# Altium schematic sheet VNA_1.SchDoc: VNA
size 409 x 289 mm; Origin: Eagle; OriginPath: C:\Users\Ground Lab\Desktop\LibreVNA\Hardware\Eagle\VNA.sch; OriginSheet: 2; OriginDescription: CLK Generation; Date: 04.05.2025 20:03:37; SheetNumber: 2; GateName_1: G$1; SymbolName_1: A3L-LOC; LibraryName: VNA; DeviceSetName: A3L-LOC; Sheet: Sheet:
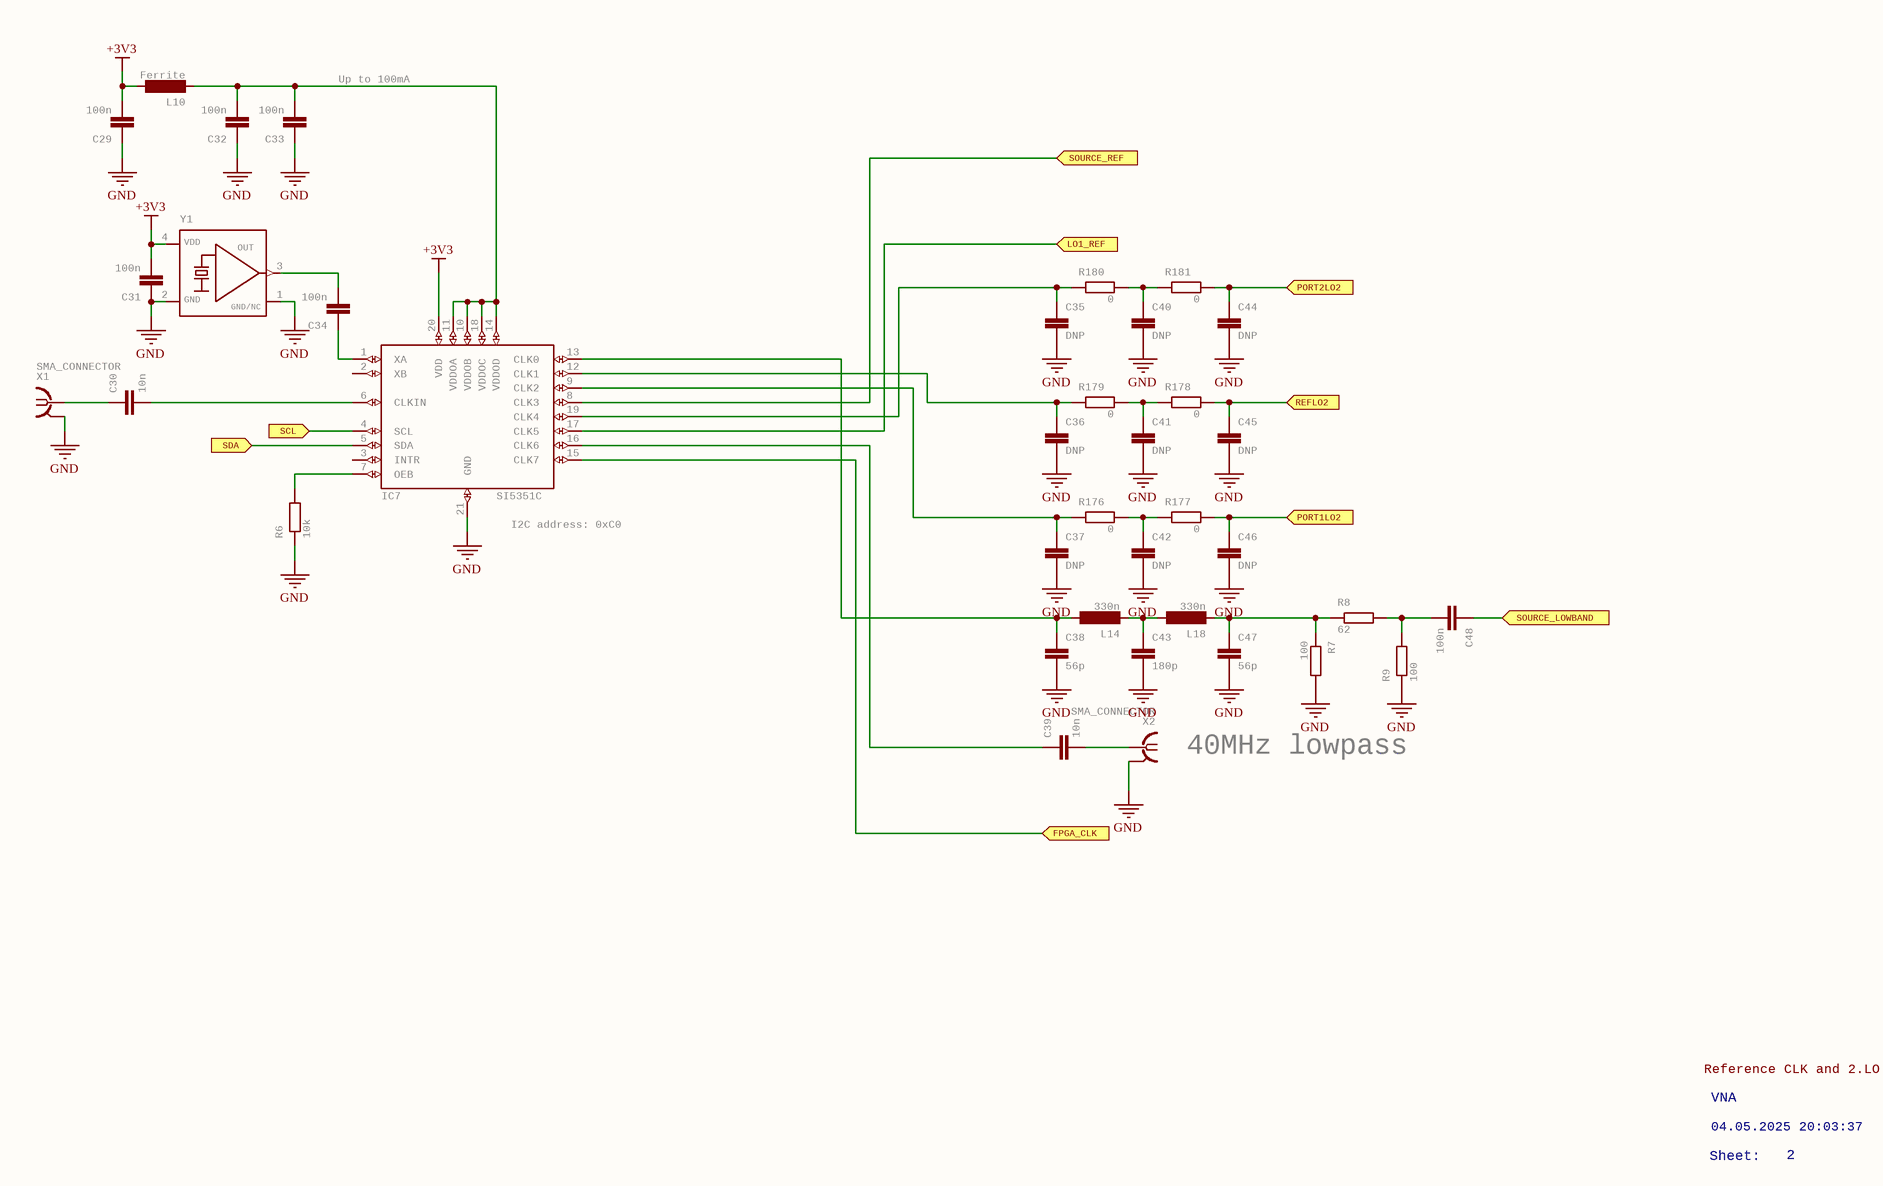
[diagram p0: VNA_1.SchDoc]

## Parts
C29  100n  [C0402]
C30  10n  [C0402]
C31  100n  [C0402]
C32  100n  [C0402]
C33  100n  [C0402]
C34  100n  [C0402]
C35  DNP  [C0402]
C36  DNP  [C0402]
C37  DNP  [C0402]
C38  56p  [C0402]
C39  10n  [C0402]
C40  DNP  [C0402]
C41  DNP  [C0402]
C42  DNP  [C0402]
C43  180p  [C0402]
C44  DNP  [C0402]
C45  DNP  [C0402]
C46  DNP  [C0402]
C47  56p  [C0402]
C48  100n  [C0402]
IC7  SI5351C  [QFN50P400X400X90-21T270N]
L10  Ferrite  [R0402]
L14  330n  [L0402]
L18  330n  [L0402]
R6  10k  [R0402]
R7  100  [R0402]
R8  62  [R0402]
R9  100  [R0402]
R176  0  [R0402]
R177  0  [R0402]
R178  0  [R0402]
R179  0  [R0402]
R180  0  [R0402]
R181  0  [R0402]
X1  SMA_CONNECTOR  [J502-ND-142-0711-821/826]
X2  SMA_CONNECTOR  [J502-ND-142-0711-821/826]
Y1  DSB221SDN/26MHz  [2.5X2.0_KXO-86-TCXO]  (value not drawn)

## Ports
FPGA_CLK (in), LO1_REF (in), PORT1LO2 (in), PORT2LO2 (in), REFLO2 (in), SCL (in), SDA (in), SOURCE_LOWBAND (in), SOURCE_REF (in)

## Nets
+3V3: C29.2 C31.2 IC7.20(VDD) L10.1 Y1.4(VDD)
GND: C29.1 C31.1 C32.1 C33.1 C35.2 C36.2 C37.2 C38.2 C40.2 C41.2 C42.2 C43.2 C44.2 C45.2 C46.2 C47.2 IC7.21(GND) R6.1 R7.2 R9.1 X1.G@1-4 X2.G@1-4 Y1.1(GND/NC) Y1.2(GND)
FPGA_CLK: IC7.15(CLK7) ; port FPGA_CLK
LO1_REF: C36.1 C37.1 IC7.9(CLK2) IC7.12(CLK1) IC7.17(CLK5) R176.1 R179.1 ; port LO1_REF
PORT1LO2: C46.1 R177.2 ; port PORT1LO2
PORT2LO2: C44.1 R181.2 ; port PORT2LO2
REFLO2: C45.1 R178.2 ; port REFLO2
SCL: IC7.4(SCL) ; port SCL
SDA: IC7.5(SDA) ; port SDA
SOURCE_LOWBAND: C48.1 ; port SOURCE_LOWBAND
SOURCE_REF: IC7.8(CLK3) ; port SOURCE_REF
NetC30_1: C30.1 X1.1
NetC30_2: C30.2 IC7.6(CLKIN)
NetC32_2: C32.2 C33.2 IC7.10(VDDOB) IC7.11(VDDOA) IC7.14(VDDOD) IC7.18(VDDOC) L10.2
NetC34_1: C34.1 IC7.1(XA)
NetC34_2: C34.2 Y1.3(OUT)
NetC35_1: C35.1 IC7.19(CLK4) R180.1
NetC38_1: C38.1 IC7.13(CLK0) L14.1
NetC39_1: C39.1 IC7.16(CLK6)
NetC39_2: C39.2 X2.1
NetC40_1: C40.1 R180.2 R181.1
NetC41_1: C41.1 R178.1 R179.2
NetC42_1: C42.1 R176.2 R177.1
NetC43_1: C43.1 L14.2 L18.1
NetC47_1: C47.1 L18.2 R7.1 R8.1
NetC48_2: C48.2 R8.2 R9.2
NetIC7_7: IC7.7(OEB) R6.2

Not connected (* = marked no-connect by the designer): IC7 2(XB) 3(INTR)

## Notes on the sheet
- (near C33) Up to 100mA
- (near IC7) I2C address: 0xC0
- 40MHz lowpass
- Reference CLK and 2.LO
- VNA
- Sheet:
- 04.05.2025 20:03:37
- 2

## Library data of the parts
C29-C48 = C-EU*?:2C0402: CAPACITOR, European symbol; GateName_1: G$1; SymbolName_1: C-EU:1; DeviceName: C0402; LibraryName: VNA; DeviceSetName: C-EU*?:2
IC7 = SI5351C: GateName_1: G$1; SymbolName_1: SI5351C; LibraryName: VNA; DeviceSetName: SI5351C
L10 = FERRITE: GateName_1: G$1; SymbolName_1: L-EU:1; LibraryName: VNA; DeviceSetName: FERRITE
L14 L18 = INDUCTOR0402: GateName_1: G$1; SymbolName_1: L-EU:1; DeviceName: 0402; LibraryName: VNA; DeviceSetName: INDUCTOR
R6-R9 R176-R181 = R-EU_R0402: RESISTOR, European symbol; GateName_1: G$1; SymbolName_1: R-EU; DeviceSetName: R-EU_; DeviceName: R0402; LibraryName: VNA
X1 X2 = SMA_CONNECTOR: GateName_1: G$1; SymbolName_1: BNC-FGND; LibraryName: VNA; DeviceSetName: SMA_CONNECTOR
Y1 = KXO-TCXO-CMOS-86: TCXO : CMOS - Serie                  	                 Model    	          Size l/w/h [mm]    	          Frequency Range    	          Frequency       Stability    	          Temp. Range [Â°C]    	          Output           	          AECQ 200       availabel    	          Datasheet    	                 KXO-86       KXO-84       KXO-83       KXO-82           	          2.5/2.0/0.7       3.2/2.5/1.0        5.0/3.2/1.5       7.0/5.0/2.4      	           13,0 ~ 40,0 MHz        10,0 ~ 40,0 MHz        10,0 ~ 40,0 MHz        10,0 ~ 30,0 MHz     	          Â±1,0 â€¦ Â±2,5ppm       Â±1,0 â€¦ Â±2,5ppm       Â±1,0 â€¦ Â±3,0ppm       Â±1,0 â€¦ Â±3,0ppm     	           (*) -30Â°C â€¦+75Â°C        (*) -40Â°C â€¦+85Â°C        (*) -40Â°C â€¦+85Â°C        (*) -30Â°C â€¦+80Â°C     	           CMOS        CMOS        CMOS        CMOS     	          -       -       -       -     	          KXO-86.pdf       KXO-84.pdf       KXO-83.pdf       KXO-82.pdf     	  	       Details see: http://www.geyer-electronic.de/Frequenz-Produkte.9.0.html   Created 2016-06-07, Hans Locher 2016 (C) Geyer Quartz Technology   KXO86,KXO84,KXO83,KXO82;2550;3225;5032;7050;2,5x2,0;3,2x2,5;2.5x2.0;3.2x2.5,5,0x3,2;7,0x5,0,5.0x3.2,7.0x5.0; GateName_1: G$1; SymbolName_1: QTCXO-HCMOS; DeviceName: -86; LibraryName: crystal-geyer_V1_0; DeviceSetName: KXO-TCXO-CMOS; OUT: OUT; GND: GND; VDD: VDD; GND/NC: GND/NC